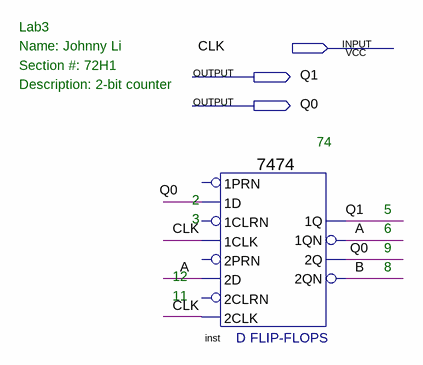
[diagram p0: schematic sheet]
// Quartus schematic Lab3_2bit_Cnt.bdf as structural Verilog: 1 symbols, 3 pins
module Lab3_2bit_Cnt (
  input  CLK,
  output Q1,
  output Q0
);

  wire A, B;

  \7474  inst (
    .\2D (A), .\1CLK (CLK), .\1D (Q0), .\2CLK (CLK), .\1QN (A), .\2Q (Q0), .\2QN (B), .\1Q (Q1));  // open: 2PRN, 1PRN, 2CLRN, 1CLRN

  // Notes on the sheet:
  //   Lab3
  //   Name: Johnny Li
  //   Section #: 72H1
  //   Description: 2-bit counter
  //   74
  //   2
  //   5
  //   3
  //   6
  //   9
  //   8
  //   12
  //   11
endmodule
